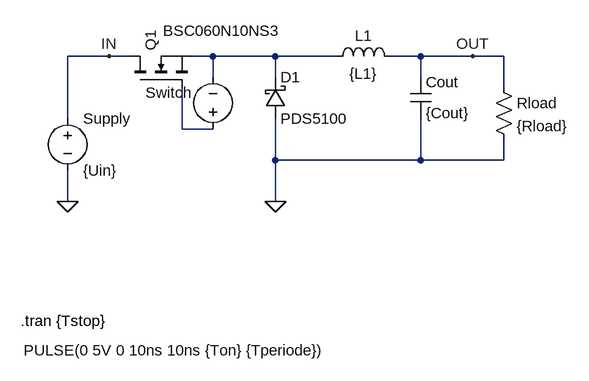
[diagram p0: schematic BuckSimple.asc]
BuckSimple.asc, the LTspice schematic file:
Version 4
SHEET 1 2836 1464
WIRE 400 368 336 368
WIRE 432 368 400 368
WIRE 560 368 528 368
WIRE 656 368 560 368
WIRE 752 368 656 368
WIRE 880 368 832 368
WIRE 960 368 880 368
WIRE 1008 368 960 368
WIRE 560 400 560 368
WIRE 656 400 656 368
WIRE 880 400 880 368
WIRE 1008 416 1008 368
WIRE 336 464 336 368
WIRE 512 480 512 416
WIRE 560 480 512 480
WIRE 656 528 656 464
WIRE 880 528 880 464
WIRE 880 528 656 528
WIRE 1008 528 1008 496
WIRE 1008 528 880 528
WIRE 336 592 336 544
WIRE 656 592 656 528
FLAG 960 368 OUT
FLAG 400 368 IN
FLAG 656 592 0
FLAG 336 592 0
SYMBOL ind 736 384 R270
WINDOW 0 32 56 VTop 2
WINDOW 3 5 56 VBottom 2
SYMATTR InstName L1
SYMATTR Value {L1}
SYMATTR SpiceLine Ipk=16.7 Rser=0.0187 Rpar=3108.6 Cpar=0
SYMBOL schottky 640 464 M180
WINDOW 0 24 64 Left 2
WINDOW 3 24 0 Left 2
SYMATTR InstName D1
SYMATTR Value PDS5100
SYMATTR Description Diode
SYMATTR Type diode
SYMBOL cap 864 400 R0
SYMATTR SpiceLine Rser=0.004
SYMATTR Value {Cout}
SYMATTR InstName Cout
SYMBOL res 992 400 R0
SYMATTR InstName Rload
SYMATTR Value {Rload}
SYMBOL voltage 336 448 R0
WINDOW 123 0 0 Left 2
WINDOW 39 0 0 Left 2
SYMATTR InstName Supply
SYMATTR Value {Uin}
SYMBOL voltage 560 496 R180
WINDOW 123 0 0 Left 2
WINDOW 39 0 0 Left 2
WINDOW 3 -176 -325 Left 2
WINDOW 0 33 72 Left 2
SYMATTR Value PULSE(0 5V 0 10ns 10ns {Ton} {Tperiode})
SYMATTR InstName Switch
SYMBOL nmos 432 416 R270
WINDOW 3 87 51 VRight 2
SYMATTR Value BSC060N10NS3
SYMATTR InstName Q1
TEXT 264 776 Left 2 !.tran {Tstop}

The netlist it stands for:
* BuckSimple.asc
L1 N001 OUT {L1} Ipk=16.7 Rser=0.0187 Rpar=3108.6 Cpar=0
D1 0 N001 PDS5100
Cout OUT 0 {Cout} Rser=0.004
Rload OUT 0 {Rload}
V§Supply IN 0 {Uin}
V§Switch N002 N001 PULSE(0 5V 0 10ns 10ns {Ton} {Tperiode})
M§Q1 IN N002 N001 N001 BSC060N10NS3
.model D D
.lib standard.dio
.model NMOS NMOS
.model PMOS PMOS
.lib standard.mos
.tran {Tstop}
.backanno
.end